# Altium schematic sheet ADC.SchDoc
size A4; Organization: Rotronic AG; Address1: Grindelstrasse 6; Address2: 8303 Bassersdorf; Address3: Switzerland; DocumentNumber: 9; SheetNumber: 9; SheetTotal: 10; Web_Address: www.rotronic.ch; E_Mail_Address: *@rotronic.ch; Fon: +41 (0)44 838 11 11; Fax: +41 (0)44 836 44 24
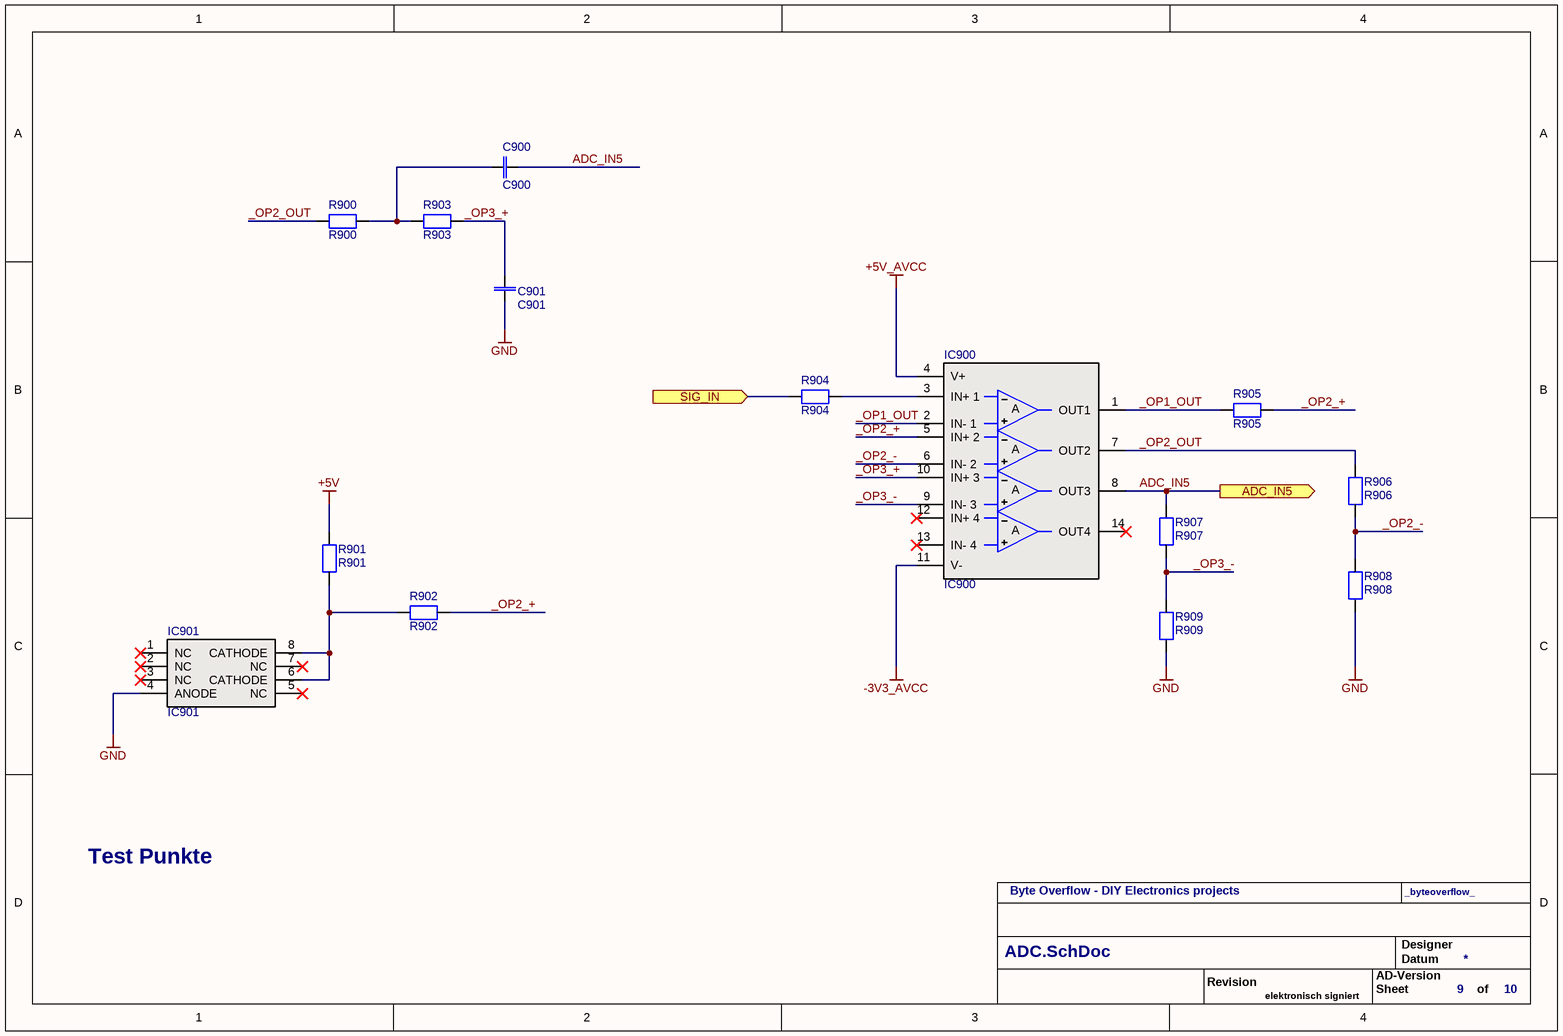
[diagram p0: ADC.SchDoc]

## Parts
C900  C900  [0603-1608]
C901  C901  [0603-1608]
IC900  IC900  [SOIC-14]
IC901  IC901  [MO-153AA]
R900  R900  [0603-1608]
R901  R901  [0805-2012]
R902  R902  [0603-1608]
R903  R903  [0603-1608]
R904  R904  [0603-1608]
R905  R905  [0603-1608]
R906  R906  [0603-1608]
R907  R907  [0603-1608]
R908  R908  [0603-1608]
R909  R909  [0603-1608]

## Ports
ADC_IN5 (out), SIG_IN (in)

## Nets
+5V: R901.1
+5V_AVCC: IC900.4(V+)
-3V3_AVCC: IC900.11(V-)
GND: C901.1 IC901.4(ANODE) R908.1 R909.1
_OP1_OUT: IC900.1(OUT1) IC900.2(IN-_1) R905.1
_OP2_+: IC900.5(IN+_2) R902.2 R905.2
_OP2_-: IC900.6(IN-_2) R906.2 R908.2
_OP2_OUT: IC900.7(OUT2) R900.1 R906.1
_OP3_+: C901.2 IC900.10(IN+_3) R903.2
_OP3_-: IC900.9(IN-_3) R907.2 R909.2
ADC_IN5: C900.2 IC900.8(OUT3) R907.1 ; port ADC_IN5
SIG_IN: R904.1 ; port SIG_IN
NetC900_1: C900.1 R900.2 R903.1
NetIC900_3: IC900.3(IN+_1) R904.2
NetIC901_6: IC901.6(CATHODE) IC901.8(CATHODE) R901.2 R902.1

Not connected (* = marked no-connect by the designer): IC900 12(IN+_4)* 13(IN-_4)* 14(OUT4)*; IC901 1(NC)* 2(NC)* 3(NC)* 5(NC)* 7(NC)*

## Notes on the sheet
- Test Punkte
- Byte Overflow - DIY Electronics projects
- _byteoverflow_
- Revision
- AD-Version
- Designer
- Datum
- elektronisch signiert
- Sheet
- of
- (in symbol I0016) A

## Library data of the parts
C900 C901 = F0058: Capacitor; Part-Number: 63.0224.1400; Manufacturer: KEMET; Manufacturer Part Number: C0603C224K4RAC7867; Designator: C 220nF 16V; ID: F0058; Operating Range: -55°C to +85°C; Note: 220nF X5R 16V 10% Taiyo Yuden EMK107BJ224KAHT; Specification: 19.09.2011 MLP; Verification: 05.07.2012 OPT; Value: 220nF 16V; Component Type: Standard; ComponentLink1Description: http://www.kemet.com/docfinder?Partnumber=C0603C224K4RACTU; ComponentLink1URL: http://www.kemet.com/docfinder?Partnumber=C0603C224K4RACTU; Status: Active; Availability Date: 15.11.2016 OPT; RoHS compliant: Yes; Flammability: n.a.; Pin Count: 2; Price 100: 0.02; Price 1000: 0.02; Price Date: 02.12.2019 Pro Alpha; Changed: 19.09.2011 MLP; Price: 0.02; Supplier 1: Digi-Key; Supplier Part Number 1: 399-5619-1-ND; Part Status: Active; RoHS: RoHS Compliant
IC900 = I0016: OPAMP; Part-Number: 00.0000.0000; Manufacturer: Texas Instruments; Designator: LMC6484IMX/NOPB; ID: I0016; Operating Range: -40°C to +125°C; Note: Operationsverstärker CMOS QUAD Rail to Rail; Changed: 19.09.2020 PEK; Value: LMC6484IMX/NOPB; Component Type: Standard; ComponentLink1Description: Datasheet; ComponentLink1URL: https://www.ti.com/lit/ds/symlink/lmc6484.pdf?ts=1600470487572&ref_url=https%253A%252F%252Fwww.ti.com%252Fstore%252Fti%252Fen%252Fp%252Fproduct%252F%253Fp%253DLMC6484IMX%252FNOPB; Status: Active; Availability Date: 19.09.2020 PEK; RoHS compliant: Yes; Flammability: n.a.; Pin Count: 14; Price 100: 1.52; Price 1000: 1.03; Price Date: 19.09.2020 PEK; Specification: 19.09.2020 PEK; Price: 2.25; Supplier 1: Mouser; Supplier Part Number 1: LMC6484IMX/NOPB; Manufacturer Part Number: LMC6484IMX/NOPB; Part Status: Active; RoHS: RoHS Compliant
IC901 = E0101: Voltage reference; Part-Number: 00.0000.0000; Manufacturer: Texas Instruments; Designator: LT1004IPWR-1-2; ID: E0101; Operating Range: -55°C to +85°C; Note: Ti LT1004IPWR-1-2 1.235V MICROPOWER INTEGRATED VOLTAGE REFERENCE; Specification: 28.10.2015 OPT; Value: LT1004IPWR-1-2; Component Type: Standard; ComponentLink1Description: Datasheet; ComponentLink1URL: http://www.ti.com/lit/ds/symlink/lt1004-1.2.pdf; Status: Active; Availability Date: 15.11.2016 OPT; RoHS compliant: Yes; Flammability: n.a.; Pin Count: 8; Price 100: 0.587; Price 1000: 0.409; Price Date: 28.10.2015 OPT; Changed: 28.10.2015 OPT; Price: 0.946; Supplier 1: Digi-Key; Supplier Part Number 1: 296-13079-1-ND; Manufacturer Part Number: LT1004IPWR-1-2; Part Status: Active; RoHS: RoHS Compliant
R900 R902-R905 R908 R909 = Q0017: Resistor; Part-Number: 71.1002.1300; Manufacturer: Vishay Dale; Manufacturer Part Number: CRCW060310K0FKEAHP; Designator: R 10k 1%; ID: Q0017; Operating Range: -55°C to +155°C; Note: 10k 1% 100ppm 1/10W Vishay CRCW060310K0FKEA; Changed: 19.09.2011 MLP; Verification: 05.07.2012 OPT; Value: 10k; Component Type: Standard; ComponentLink1Description: http://www.vishay.com/docs/20043/crcwhpe3.pdf; ComponentLink1URL: http://www.vishay.com/docs/20043/crcwhpe3.pdf; Status: Active; Availability Date: 16.11.2016 OPT; RoHS compliant: Yes; Flammability: n.a.; Pin Count: 2; Price 100: 0.002; Price 1000: 0.002; Price Date: 02.12.2019 Pro Alpha; Specification: 19.09.2011 MLP; Price: 0.001; Supplier: Digi-Key; Supplier Part Number: 541-10.0KSCT-ND; Part Status: Active; RoHS: RoHS Compliant
R901 = Q0328: Resistor; Part-Number: 71.1003.1700; Manufacturer: Vishay Dale; Manufacturer Part Number: CRCW0805100KFKEA; Designator: R 100k 1.0%; ID: Q0328; Operating Range: -55°C to +155°C; Note: 100k 1.0% 100ppm 1/8W Vishay CRCW0805100KFKEA; Changed: 28.07.2015 OPT; Value: 100k 1.0%; Component Type: Standard; ComponentLink1Description: Datasheet; ComponentLink1URL: http://www.vishay.com/docs/20035/dcrcwe3.pdf; Status: Active; Availability Date: 16.11.2016 OPT; RoHS compliant: Yes; Flammability: n.a.; Pin Count: 2; Price 100: 0.026; Price 1000: 0.018; Price Date: 02.12.2019 Pro Alpha; Specification: 28.07.2015 OPT; Price: 0.009; Supplier: Digi-Key; Supplier Part Number: 541-100KCCT-ND; Part Status: Active; RoHS: RoHS Compliant
R906 R907 = Q0180: Resistor; Part-Number: 71.6801.1300; Manufacturer: Vishay Dale; Manufacturer Part Number: CRCW06036K80FKEA; Designator: R 6.8k 1%; ID: Q0180; Operating Range: -55°C to +155°C; Note: 6.8k 1% 100ppm 1/10W Vishay CRCW06036K80FKEA; Changed: 19.09.2011 MLP; Verification: 05.07.2012 OPT; Value: 6.8k 1%; Component Type: Standard; ComponentLink1Description: http://www.vishay.com/docs/20035/dcrcwe3.pdf; ComponentLink1URL: http://www.vishay.com/docs/20035/dcrcwe3.pdf; Status: Active; Availability Date: 16.11.2016 OPT; RoHS compliant: Yes; Flammability: n.a.; Pin Count: 2; Price 100: 0.002; Price 1000: 0.002; Price Date: 02.12.2019 Pro Alpha; Specification: 19.09.2011 MLP; Price: 0.002; Supplier: Digi-Key; Supplier Part Number: 541-6.80KHCT-ND; Part Status: Active; RoHS: RoHS Compliant